# EAGLE schematic Arduino_MEGA_2560-Rev3 (EAGLE 8.3.2)
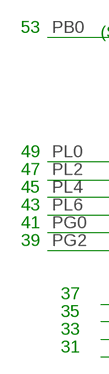
[diagram p0: schematic, sheet 1, part 1 of 2]
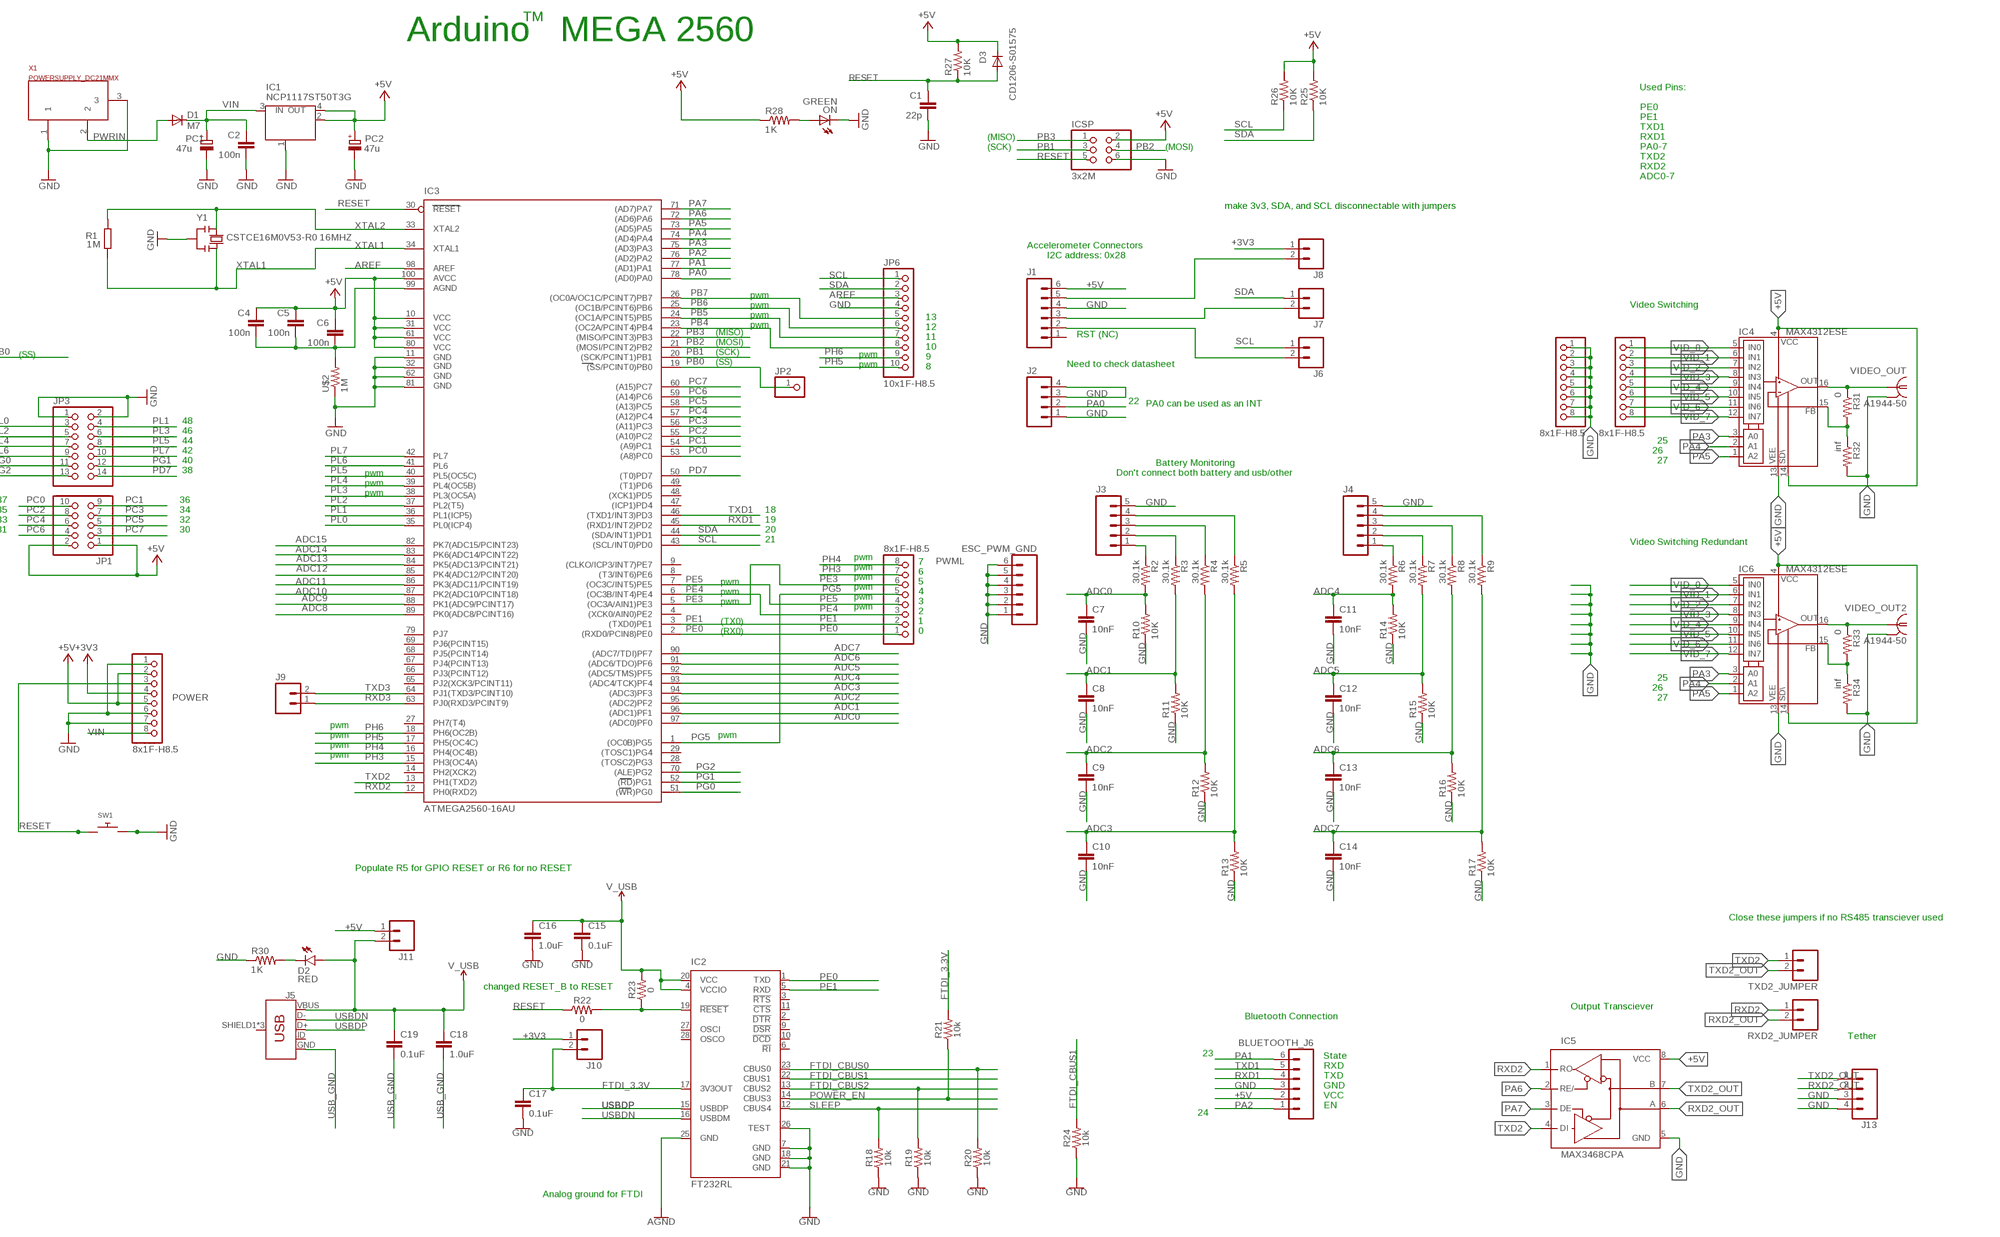
[diagram p1: schematic, sheet 1, part 2 of 2]

## Parts
BLUETOOTH_J6  M06LONGPADS  [1X06_LONGPADS]
C1  22p  C-EU0603-RND  [C0603-ROUND]
C2  100n  C-EU0603-RND  [C0603-ROUND]
C4  100n  C-EU0603-RND  [C0603-ROUND]
C5  100n  C-EU0603-RND  [C0603-ROUND]
C6  100n  C-EU0603-RND  [C0603-ROUND]
C7  10nF  10NF/10000PF-50V-10%(0603)  [0603-CAP]
C8  10nF  10NF/10000PF-50V-10%(0603)  [0603-CAP]
C9  10nF  10NF/10000PF-50V-10%(0603)  [0603-CAP]
C10  10nF  10NF/10000PF-50V-10%(0603)  [0603-CAP]
C11  10nF  10NF/10000PF-50V-10%(0603)  [0603-CAP]
C12  10nF  10NF/10000PF-50V-10%(0603)  [0603-CAP]
C13  10nF  10NF/10000PF-50V-10%(0603)  [0603-CAP]
C14  10nF  10NF/10000PF-50V-10%(0603)  [0603-CAP]
C15  0.1uF  0.1UF-0603-25V-5%  [0603]
C16  1.0uF  1.0UF-0603-16V-10%  [0603]
C17  0.1uF  0.1UF-0603-25V-5%  [0603]
C18  1.0uF  1.0UF-0603-16V-10%  [0603]
C19  0.1uF  0.1UF-0603-25V-5%  [0603]
D1  M7  DIODE-SMB  [SMB]
D2  RED  LED-RED0603  [LED-0603]
D3  CD1206-S01575  DIODE-MINIMELF  [MINIMELF]
ESC_PWM_GND  M06LONGPADS  [1X06_LONGPADS]
IC1  NCP1117ST50T3G  MC33269ST-3.3T3  [SOT223]
IC2  FT232RL  [SSOP28]
IC3  ATMEGA2560-16AU  ATMEGA25602560-16AU  [TQFP100]
IC4  MAX4312ESE  [SO16]
IC5  MAX3468CPA  [DIL08]
IC6  MAX4312ESE  [SO16]
ICSP  3x2M  PINHD-2X3  [2X03]
J1  M06LONGPADS  [1X06_LONGPADS]
J2  M04LONGPADS  [1X04_LONGPADS]
J3  M05JST-VERT  [JST-5-PTH-VERT]
J4  M05JST-VERT  [JST-5-PTH-VERT]
J5  USB_MICRO-B_FEMALE-SMT  [USB-B-MICRO-SMD]
J6  M02PTH  [1X02]
J7  M02PTH  [1X02]
J8  M02PTH  [1X02]
J9  M02PTH  [1X02]
J10  M02PTH  [1X02]
J11  M02PTH  [1X02]
J13  M04LONGPADS  [1X04_LONGPADS]
JP1  PINHD-2X5  [2X05]
JP2  PINHD-1X1  [1X01]
JP3  PINHD-2X7  [2X07]
JP6  10x1F-H8.5  PINHD-1X10_ARD  [1X10]
ON  GREEN  LEDCHIP-LED0805  [CHIP-LED0805]
PC1  47u  CPOL-EUD  [PANASONIC_D]
PC2  47u  CPOL-EUD  [PANASONIC_D]
POWER  8x1F-H8.5  PINHD-1X8  [1X08]
PWML  8x1F-H8.5  PINHD-1X8  [1X08]
R1  1M  R-EU_R0603  [R0603-ROUND]
R2  30.1k  30.1KOHM1/10W1%(0603)  [0603-RES]
R3  30.1k  30.1KOHM1/10W1%(0603)  [0603-RES]
R4  30.1k  30.1KOHM1/10W1%(0603)  [0603-RES]
R5  30.1k  30.1KOHM1/10W1%(0603)  [0603-RES]
R6  30.1k  30.1KOHM1/10W1%(0603)  [0603-RES]
R7  30.1k  30.1KOHM1/10W1%(0603)  [0603-RES]
R8  30.1k  30.1KOHM1/10W1%(0603)  [0603-RES]
R9  30.1k  30.1KOHM1/10W1%(0603)  [0603-RES]
R10  10K  10KOHM-1/10W-1%(0603)0603  [0603-RES]
R11  10K  10KOHM-1/10W-1%(0603)0603  [0603-RES]
R12  10K  10KOHM-1/10W-1%(0603)0603  [0603-RES]
R13  10K  10KOHM-1/10W-1%(0603)0603  [0603-RES]
R14  10K  10KOHM-1/10W-1%(0603)0603  [0603-RES]
R15  10K  10KOHM-1/10W-1%(0603)0603  [0603-RES]
R16  10K  10KOHM-1/10W-1%(0603)0603  [0603-RES]
R17  10K  10KOHM-1/10W-1%(0603)0603  [0603-RES]
R18  10k  10KOHM-0603-1/10W-1%  [0603]
R19  10k  10KOHM-0603-1/10W-1%  [0603]
R20  10k  10KOHM-0603-1/10W-1%  [0603]
R21  10k  10KOHM-0603-1/10W-1%  [0603]
R22  0  0OHM-0603-1/10W-5%  [0603]
R23  0  0OHM-0603-1/10W-5%  [0603]
R24  10k  10KOHM-0603-1/10W-1%  [0603]
R25  10K  10KOHM-1/10W-1%(0603)0603  [0603-RES]
R26  10K  10KOHM-1/10W-1%(0603)0603  [0603-RES]
R27  10K  10KOHM-1/10W-1%(0603)0603  [0603-RES]
R28  1K  1KOHM-1/10W-1%(0603)  [0603-RES]
R30  1K  1KOHM-1/10W-1%(0603)  [0603-RES]
R31  0  30.1KOHM1/10W1%(0603)  [0603-RES]
R32  inf  30.1KOHM1/10W1%(0603)  [0603-RES]
R33  0  30.1KOHM1/10W1%(0603)  [0603-RES]
R34  inf  30.1KOHM1/10W1%(0603)  [0603-RES]
RXD2_JUMPER  M02PTH  [1X02]
SW1  SWITCH_PUSHBUTTONC&K_KSS  [BTN_CK_KSS]
TXD2_JUMPER  M02PTH  [1X02]
U$2  1M  820KOHM-1/10W-1%(0603)  [0603-RES]
VIDEO_IN  8x1F-H8.5  PINHD-1X8  [1X08]
VIDEO_IN_GND  8x1F-H8.5  PINHD-1X8  [1X08]
VIDEO_OUT  A1944-50  [A1944]
VIDEO_OUT2  A1944-50  [A1944]
X1  POWERSUPPLY_DC21MMX  [POWERSUPPLY_DC-21MM]
Y1  CSTCE16M0V53-R0 16MHZ  RESONATORMU  [RESONATOR]

## Nets
+3V3 [power]: J8.1 J10.1 POWER.4
+5V [power usb]: BLUETOOTH_J6.2 C4.1 C5.1 C6.1 D3.C IC1.2(OUT) IC1.4(OUT) IC3.10(VCC) IC3.31(VCC1) IC3.61(VCC2) IC3.80(VCC3) IC3.100(AVCC) IC4.4(V+) IC4.14(!SHDN) IC5.8(VCC) IC6.4(V+) IC6.14(!SHDN) ICSP.2 J1.6 J11.1 JP1.1 JP1.2 PC2.+ POWER.2 POWER.5 R25.2 R26.2 R27.2 R28.1
ADC0: C7.1 IC3.97((ADC0)PF0) R2.2 R10.2
ADC1: C8.1 IC3.96((ADC1)PF1) R3.2 R11.2
ADC2: C9.1 IC3.95((ADC2)PF2) R4.2 R12.2
ADC3: C10.1 IC3.94((ADC3)PF3) R5.2 R13.2
ADC4: C11.1 IC3.93((ADC4/TCK)PF4) R6.2 R14.2
ADC5: C12.1 IC3.92((ADC5/TMS)PF5) R7.2 R15.2
ADC6: C13.1 IC3.91((ADC6/TDO)PF6) R8.2 R16.2
ADC7: C14.1 IC3.90((ADC7/TDI)PF7) R9.2 R17.2
ADC8: IC3.89(PK0(ADC8/PCINT16))
ADC9: IC3.88(PK1(ADC9/PCINT17))
ADC10: IC3.87(PK2(ADC10/PCINT18))
ADC11: IC3.86(PK3(ADC11/PCINT19))
ADC12: IC3.85(PK4(ADC12/PCINT20))
ADC13: IC3.84(PK5(ADC13/PCINT21))
ADC14: IC3.83(PK6(ADC14/PCINT22))
ADC15: IC3.82(PK7(ADC15/PCINT23))
AGND: C4.2 C5.2 C6.2 IC2.25(GND) IC3.99(AGND) U$2.2
AREF: IC3.98(AREF) JP6.3
FTDI_3.3V: C17.1 IC2.17(3V3OUT) J10.2 R21.2
FTDI_CBUS0: IC2.23(CBUS0) R20.2
FTDI_CBUS1: IC2.22(CBUS1) R24.2
FTDI_CBUS2: IC2.13(CBUS2) R19.2
GND [gnd]: BLUETOOTH_J6.3 C1.2 C2.2 C7.2 C8.2 C9.2 C10.2 C11.2 C12.2 C13.2 C14.2 C15.2 C16.2 C17.2 ESC_PWM_GND.1 ESC_PWM_GND.2 ESC_PWM_GND.3 ESC_PWM_GND.4 ESC_PWM_GND.5 ESC_PWM_GND.6 IC1.1(GND/ADJ) IC2.7(GND) IC2.18(GND) IC2.21(GND) IC2.26(TEST) IC3.11(GND) IC3.32(GND1) IC3.62(GND2) IC3.81(GND3) IC4.13(V-) IC5.5(GND) IC6.13(V-) ICSP.6 J1.4 J2.1 J2.3 J2.4 J3.5 J4.5 J13.3 J13.4 JP3.1 JP3.2 JP6.4 ON.C PC1.- PC2.- POWER.1 POWER.6 POWER.7 R10.1 R11.1 R12.1 R13.1 R14.1 R15.1 R16.1 R17.1 R18.1 R19.1 R20.1 R24.1 R30.1 R32.2 R34.2 SW1.P$2 U$2.1 VIDEO_IN_GND.1 VIDEO_IN_GND.2 VIDEO_IN_GND.3 VIDEO_IN_GND.4 VIDEO_IN_GND.5 VIDEO_IN_GND.6 VIDEO_IN_GND.7 VIDEO_IN_GND.8 VIDEO_OUT2.2 VIDEO_OUT2.3 VIDEO_OUT2.4 VIDEO_OUT2.5 VIDEO_OUT.2 VIDEO_OUT.3 VIDEO_OUT.4 VIDEO_OUT.5 X1.1 X1.3 Y1.2
N$1: J3.1 R2.1
N$3: ON.A R28.2
N$4: IC2.19(!RESET) R22.2 R23.1
N$5: J4.1 R6.1
N$6: J3.2 R3.1
N$7: J1.5 J8.2
N$8: J3.3 R4.1
N$9: J1.3 J7.2
N$10: J3.4 R5.1
N$11: J1.2 J6.2
N$12: J4.2 R7.1
N$13: J4.3 R8.1
N$14: J4.4 R9.1
N$15: D2.C R30.2
N$17: IC4.15(FB) R31.2 R32.1
N$18: IC6.15(FB) R33.2 R34.1
PA0: IC3.78((AD0)PA0) J2.2
PA1: BLUETOOTH_J6.6 IC3.77((AD1)PA1)
PA2: BLUETOOTH_J6.1 IC3.76((AD2)PA2)
PA3: IC3.75((AD3)PA3) IC4.3(A0) IC6.3(A0)
PA4: IC3.74((AD4)PA4) IC4.2(A1) IC6.2(A1)
PA5: IC3.73((AD5)PA5) IC4.1(A2) IC6.1(A2)
PA6: IC3.72((AD6)PA6) IC5.2(RE/)
PA7: IC3.71((AD7)PA7) IC5.3(DE)
PB0: IC3.19((SS/PCINT0)PB0) JP2.1
PB1: IC3.20((SCK/PCINT1)PB1) ICSP.3
PB2: IC3.21((MOSI/PCINT2)PB2) ICSP.4
PB3: IC3.22((MISO/PCINT3)PB3) ICSP.1
PB4: IC3.23((OC2A/PCINT4)PB4) JP6.8
PB5: IC3.24((OC1A/PCINT5)PB5) JP6.7
PB6: IC3.25((OC1B/PCINT6)PB6) JP6.6
PB7: IC3.26((OC0A/OC1C/PCINT7)PB7) JP6.5
PC0: IC3.53((A8)PC0) JP1.10
PC1: IC3.54((A9)PC1) JP1.9
PC2: IC3.55((A10)PC2) JP1.8
PC3: IC3.56((A11)PC3) JP1.7
PC4: IC3.57((A12)PC4) JP1.6
PC5: IC3.58((A13)PC5) JP1.5
PC6: IC3.59((A14)PC6) JP1.4
PC7: IC3.60((A15)PC7) JP1.3
PD7: IC3.50((T0)PD7) JP3.14
PE0: IC2.1(TXD) IC3.2((RXD0/PCIN8)PE0) PWML.1
PE1: IC2.5(RXD) IC3.3((TXD0)PE1) PWML.2
PE3: IC3.5((OC3A/AIN1)PE3) PWML.6
PE4: IC3.6((OC3B/INT4)PE4) PWML.3
PE5: IC3.7((OC3C/INT5)PE5) PWML.4
PG0: IC3.51((WR)PG0) JP3.11
PG1: IC3.52((RD)PG1) JP3.12
PG2: IC3.70((ALE)PG2) JP3.13
PG5: IC3.1((OC0B)PG5) PWML.5
PH3: IC3.15(PH3(OC4A)) PWML.7
PH4: IC3.16(PH4(OC4B)) PWML.8
PH5: IC3.17(PH5(OC4C)) JP6.10
PH6: IC3.18(PH6(OC2B)) JP6.9
PL0: IC3.35(PL0(ICP4)) JP3.3
PL1: IC3.36(PL1(ICP5)) JP3.4
PL2: IC3.37(PL2(T5)) JP3.5
PL3: IC3.38(PL3(OC5A)) JP3.6
PL4: IC3.39(PL4(OC5B)) JP3.7
PL5: IC3.40(PL5(OC5C)) JP3.8
PL6: IC3.41(PL6) JP3.9
PL7: IC3.42(PL7) JP3.10
POWER_EN: IC2.14(CBUS3) R21.1
PWRIN [power]: D1.A X1.2
RESET: C1.1 D3.A IC3.30(RESET) ICSP.5 POWER.3 R22.1 R27.1 SW1.P$1
RXD1: BLUETOOTH_J6.4 IC3.45((RXD1/INT2)PD2)
RXD2: IC3.12(PH0(RXD2)) IC5.1(RO) RXD2_JUMPER.1
RXD2_OUT: IC5.6(A) J13.2 RXD2_JUMPER.2
RXD3: IC3.63(PJ0(RXD3/PCINT9)) J9.1
SCL: IC3.43((SCL/INT0)PD0) J6.1 JP6.1 R26.1
SDA: IC3.44((SDA/INT1)PD1) J7.1 JP6.2 R25.1
SLEEP: IC2.12(CBUS4) R18.2
TXD1: BLUETOOTH_J6.5 IC3.46((TXD1/INT3)PD3)
TXD2: IC3.13(PH1(TXD2)) IC5.4(DI) TXD2_JUMPER.1
TXD2_OUT: IC5.7(B) J13.1 TXD2_JUMPER.2
TXD3: IC3.64(PJ1(TXD3/PCINT10)) J9.2
USB_GND: C18.2 C19.2 J5.GND
USBDN: IC2.16(USBDM) J5.D-
USBDP: IC2.15(USBDP) J5.D+
V_USB: C15.1 C16.1 C18.1 C19.1 D2.A IC2.4(VCCIO) IC2.20(VCC) J5.VBUS J11.2 R23.2
VID_0: IC4.5(IN0) IC6.5(IN0) VIDEO_IN.1
VID_1: IC4.6(IN1) IC6.6(IN1) VIDEO_IN.2
VID_2: IC4.7(IN2) IC6.7(IN2) VIDEO_IN.3
VID_3: IC4.8(IN3) IC6.8(IN3) VIDEO_IN.4
VID_4: IC4.9(IN4) IC6.9(IN4) VIDEO_IN.5
VID_5: IC4.10(IN5) IC6.10(IN5) VIDEO_IN.6
VID_6: IC4.11(IN6) IC6.11(IN6) VIDEO_IN.7
VID_7: IC4.12(IN7) IC6.12(IN7) VIDEO_IN.8
VIDEO_OUT: IC4.16(OUT) R31.1 VIDEO_OUT.1
VIDEO_OUT1: IC6.16(OUT) R33.1 VIDEO_OUT2.1
VIN [power]: C2.1 D1.C IC1.3(IN) PC1.+ POWER.8
XTAL1: IC3.34(XTAL1) R1.1 Y1.3
XTAL2: IC3.33(XTAL2) R1.2 Y1.1
Unconnected: IC2.2(!DTR) IC2.3(!RTS) IC2.6(!RI) IC2.9(!DSR) IC2.10(!DCD) IC2.11(!CTS) IC2.27(OSCI) IC2.28(OSCO) IC3.4((XCK0/AIN0)PE2) IC3.8((T3/INT6)PE6) IC3.9((CLKO/ICP3/INT7)PE7) IC3.14(PH2(XCK2)) IC3.27(PH7(T4)) IC3.28((TOSC2)PG3) IC3.29((TOSC1)PG4) IC3.47((ICP1)PD4) IC3.48((XCK1)PD5) IC3.49((T1)PD6) IC3.65(PJ2(XCK3/PCINT11)) IC3.66(PJ3(PCINT12)) IC3.67(PJ4(PCINT13)) IC3.68(PJ5(PCINT14)) IC3.69(PJ6(PCINT15)) IC3.79(PJ7) J1.1 J5.ID J5.SHIELD1(SHIELD) J5.SHIELD2(SHIELD) J5.SHIELD3(SHIELD)

## Notes on the sheet
- TM
- Arduino   MEGA 2560
- Used Pins:
- PE0
- PE1
- TXD1
- (MISO) | RXD1
- (SCK) | (MOSI) | PA0-7
- TXD2
- RXD2
- ADC0-7
- make 3v3, SDA, and SCL disconnectable with jumpers
- Accelerometer Connectors
- I2C address: 0x28
- pwm
- pwm | Video Switching
- pwm | 13
- pwm | 12
- (MISO) | RST (NC)
- 11
- (MOSI)
- 10
- 53 | (SS) | (SCK) | pwm
- 9
- (SS) | pwm | Need to check datasheet
- 8
- 22 | PA0 can be used as an INT
- 49 | 48
- 47 | 46
- 45 | 44 | 25
- 43 | 42 | 26
- 41 | 40 | Battery Monitoring | 27
- 39 | 38 | pwm | Don't connect both battery and usb/other
- pwm
- pwm
- 37 | 36
- 35 | 34 | 18
- 33 | 32 | 19
- 31 | 30 | 20
- 21 | Video Switching Redundant
- pwm
- 7
- pwm
- 6
- pwm
- pwm | 5
- pwm
- pwm | 4
- pwm
- pwm | 3
- pwm
- 2
- (TX0) | 1
- (RX0) | 0
- 25
- 26
- 27
- pwm
- pwm | pwm
- pwm
- pwm
- Populate R5 for GPIO RESET or R6 for no RESET
- Close these jumpers if no RS485 transciever used
- changed RESET_B to RESET
- Output Transciever
- Bluetooth Connection
- Tether
- 23 | State
- RXD
- TXD
- GND
- VCC
- EN
- 24
- Analog ground for FTDI

## Library data of the parts
BLUETOOTH_J6 ESC_PWM_GND J1 = SparkFun-Connectors:M06: Header 6 Standard 6-pin 0.1" header. Use with straight break away headers (SKU : PRT-00116), right angle break away headers (PRT-00553), swiss pins (PRT-00743), machine pins (PRT-00117), and female headers (PRT-00115). Molex polarized connector foot print use with SKU : PRT-08094 with associated crimp pins and housings. NOTES ON THE VARIANTS LOCK and LOCK_LONGPADS... This footprint was designed to help hold the alignment of a through-hole component (i.e. 6-pin header) while soldering it into place. You may notice that each hole has been shifted either up or down by 0.005 of an inch from it's more standard position (which is a perfectly straight line). This slight alteration caused the pins (the squares in the middle) to touch the edges of the holes. Because they are alternating, it causes a "brace" to hold the component in place. 0.005 has proven to be the perfect amount of "off-center" position when using our standard breakaway headers. Although looks a little odd when you look at the bare footprint, once you have a header in there, the alteration is very hard to notice. Also,if you push a header all the way into place, it is covered up entirely on the bottom side. This idea of altering the position of holes to aid alignment will be further integrated into the Sparkfun Library for other footprints. It can help hold any component with 3 or more connection pins.
C1 C2 C4-C6 = SmartPrj:C-EU: CAPACITOR, European symbol
C7-C14 = SparkFun-Capacitors:10NF/10000PF-50V-10%(0603): CAP-00867; PROD_ID: CAP-00867
C15 C17 C19 = SparkFun-Capacitors:0.1UF: 0.1µF ceramic capacitors A capacitor is a passive two-terminal electrical component used to store electrical energy temporarily in an electric field.; PROD_ID: CAP-08604
C16 C18 = SparkFun-Capacitors:1.0UF: 1µF ceramic capacitors A capacitor is a passive two-terminal electrical component used to store electrical energy temporarily in an electric field.; PROD_ID: CAP-00868
D1 D3 = diode:DIODE-: DIODE
D2 = SparkFun-LED:LED-RED: Assorted Red LEDs LilyPad 1206- DIO-09912 1206- DIO-00809 0603- DIO-00819 "SMART" means more efficient and expensive; PROD_ID: DIO-00819
IC1 = linear:MC33269ST*: Adjustable Output Low Dropout Voltage Regulator 800 mA Source: http://www.onsemi.com/pub/Collateral/MC33269-D.PDF
IC2 = ftdichip:FT232R: Source: http://www.ftdichip.com/Documents/DataSheets/DS_FT232R_v104.pdf; MPN: FT232RL; OC_FARNELL: 1146032; OC_NEWARK: 91K9918
IC3 = SmartPrj:ATMEGA2560: MICROCONTROLLER 64/128/256 Kbytes FLASH 4 Kbytes EEPROM 8 Kbytes SRAM 86 General Purpose I/O pins 12-channels16-bit PWM 4 x Serial USARTs 16-channels 10-bit A/D
IC4 IC6 = maxim:MAX4312: Video Multiplexer-Amplifier High-Speed, Low-Power, Single-Supply, Multichannel; MPN: MAX4312ESE+; OC_FARNELL: unknown; OC_NEWARK: 53K6837
IC5 = maxim:MAX34*: +5V, Fail-Safe, 40Mbps, Profibus RS-485/RS-422 Transceivers Source: MAX3465-MAX3469.pdf; OC_FARNELL: unknown; OC_NEWARK: unknown
ICSP = SmartPrj:PINHD-2X3: PIN HEADER
J2 J13 = SparkFun-Connectors:M04: Header 4 Standard 4-pin 0.1" header. Use with straight break away headers (SKU : PRT-00116), right angle break away headers (PRT-00553), swiss pins (PRT-00743), machine pins (PRT-00117), and female headers (PRT-00115). Molex polarized connector foot print use with SKU : PRT-08231 with associated crimp pins and housings. 1MM SMD Version SKU: PRT-10208; PROD_ID: CONN-09696
J3 J4 = SparkFun-Connectors:M05: Header 5 Standard 5-pin 0.1" header. Use with straight break away headers (SKU : PRT-00116), right angle break away headers (PRT-00553), swiss pins (PRT-00743), machine pins (PRT-00117), and female headers (PRT-00115). Molex polarized connector foot print use with SKU : PRT-08230 with associated crimp pins and housings.
J5 = SparkFun-Connectors:USB_MICRO-B: USB Type Micro-B Connector Male/female and PTH/SMT variants SparkFun Products: SparkFun microB USB Breakout <https://www.sparkfun.com/products/12035> SparkFun USB microB Plug Breakout <https://www.sparkfun.com/products/10031> SparkFun ESP8266 Thing <https://www.sparkfun.com/products/13231>; PROD_ID: CONN-11752
J6-J11 RXD2_JUMPER TXD2_JUMPER = SparkFun-Connectors:M02: Standard 2-pin 0.1" header. Use with - straight break away headers ( PRT-00116) - right angle break away headers (PRT-00553) - swiss pins (PRT-00743) - machine pins (PRT-00117) - female headers (PRT-00115) Molex polarized connector foot print use with: PRT-08233 with associated crimp pins and housings. 2.54_SCREWTERM for use with PRT-10571. 3.5mm Screw Terminal footprints for PRT-08084 5mm Screw Terminal footprints for use with PRT-08432
JP1 = pinhead:PINHD-2X5: PIN HEADER
JP2 = pinhead:PINHD-1X1: PIN HEADER
JP3 = pinhead:PINHD-2X7: PIN HEADER
JP6 = SmartPrj:PINHD-1X10_ARD: PIN HEADER
ON = led:LED: LED OSRAM: - CHIPLED LG R971, LG N971, LY N971, LG Q971, LY Q971, LO R971, LY R971 LH N974, LH R974 LS Q976, LO Q976, LY Q976 LO Q996 - Hyper CHIPLED LW Q18S LB Q993, LB Q99A, LB R99A - SideLED LS A670, LO A670, LY A670, LG A670, LP A670 LB A673, LV A673, LT A673, LW A673 LH A674 LY A675 LS A676, LA A676, LO A676, LY A676, LW A676 LS A679, LY A679, LG A679 - Hyper Micro SIDELED® LS Y876, LA Y876, LO Y876, LY Y876 LT Y87S - SmartLED LW L88C, LW L88S LB L89C, LB L89S, LG L890 LS L89K, LO L89K, LY L89K LS L896, LA L896, LO L896, LY L896 - TOPLED LS T670, LO T670, LY T670, LG T670, LP T670 LSG T670, LSP T670, LSY T670, LOP T670, LYG T670 LG T671, LOG T671, LSG T671 LB T673, LV T673, LT T673, LW T673 LH T674 LS T676, LA T676, LO T676, LY T676, LB T676, LH T676, LSB T676, LW T676 LB T67C, LV T67C, LT T67C, LS T67K, LO T67K, LY T67K, LW E67C LS E67B, LA E67B, LO E67B, LY E67B, LB E67C, LV E67C, LT E67C LW T67C LS T679, LY T679, LG T679 LS T770, LO T770, LY T770, LG T770, LP T770 LB T773, LV T773, LT T773, LW T773 LH T774 LS E675, LA E675, LY E675, LS T675 LS T776, LA T776, LO T776, LY T776, LB T776 LHGB T686 LT T68C, LB T68C - Hyper Mini TOPLED® LB M676 - Mini TOPLED Santana® LG M470 LS M47K, LO M47K, LY M47K Source: http://www.osram.convergy.de LUXEON: - LUMILED® LXK2-PW12-R00, LXK2-PW12-S00, LXK2-PW14-U00, LXK2-PW14-V00 LXK2-PM12-R00, LXK2-PM12-S00, LXK2-PM14-U00 LXK2-PE12-Q00, LXK2-PE12-R00, LXK2-PE12-S00, LXK2-PE14-T00, LXK2-PE14-U00 LXK2-PB12-K00, LXK2-PB12-L00, LXK2-PB12-M00, LXK2-PB14-N00, LXK2-PB14-P00, LXK2-PB14-Q00 LXK2-PR12-L00, LXK2-PR12-M00, LXK2-PR14-Q00, LXK2-PR14-R00 LXK2-PD12-Q00, LXK2-PD12-R00, LXK2-PD12-S00 LXK2-PH12-R00, LXK2-PH12-S00 LXK2-PL12-P00, LXK2-PL12-Q00, LXK2-PL12-R00 Source: www.luxeon.com KINGBRIGHT: KA-3528ASYC Source: www.kingbright.com
PC1 PC2 = rcl:CPOL-EU: POLARIZED CAPACITOR, European symbol
POWER PWML VIDEO_IN VIDEO_IN_GND = SmartPrj:PINHD-1X8: PIN HEADER
R1 = SmartPrj:R-EU_: RESISTOR, European symbol
R2-R9 = SparkFun-Resistors:30.1KOHM1/10W1%(0603): RES-08595; PROD_ID: RES-08595
R10-R17 R25-R27 = SparkFun-Resistors:10KOHM-1/10W-1%(0603): RES-00824; PROD_ID: RES-00824
R18-R21 R24 = SparkFun-Resistors:10KOHM: 10kΩ resistor A resistor is a passive two-terminal electrical component that implements electrical resistance as a circuit element. Resistors act to reduce current flow, and, at the same time, act to lower voltage levels within circuits. - Wikipedia; PROD_ID: RES-00824
R22 R23 = SparkFun-Resistors:0OHM: 0Ω resistor A resistor is a passive two-terminal electrical component that implements electrical resistance as a circuit element. Resistors act to reduce current flow, and, at the same time, act to lower voltage levels within circuits. - Wikipedia; PROD_ID: RES-08609
R28 R30 = SparkFun-Resistors:1KOHM-1/10W-1%(0603): RES-07856; PROD_ID: RES-07856
R31-R34 = SparkFun-Resistors:30.1KOHM1/10W1%(0603): RES-08595; PROD_ID: RES-08595; VALUE: 30.1k
SW1 = adafruit:SWITCH_PUSHBUTTON: Buttons SOFTTOUCHSMD_SJ - Soft touch temporary push button (Super Junk Akihabara) Compatible with SKPMANE010 [Mouser: 688-SKPMAN] C&K_KSS = Digikey: KSS221GLFS
U$2 = SparkFun-Resistors:820KOHM-1/10W-1%(0603); PROD_ID: RES-13247
VIDEO_OUT VIDEO_OUT2 = con-coax:A1944-50: BNC CONNECTOR 50 Ohm distributor Buerklin 78F2475; OC_FARNELL: unknown; OC_NEWARK: unknown
X1 = SmartPrj:POWERSUPPLY_DC21MM
Y1 = SmartPrj:RESONATOR

## Net classes
1 power: width 0.61 mm, drill 0.406 mm, clearance 0.203 mm
2 gnd: width 0.305 mm, drill 0.406 mm, clearance 0.203 mm
3 power usb: width 0.508 mm, drill 0.406 mm, clearance 0.203 mm